# EAGLE design InternetButtonBuzzer (EAGLE 7.7.0)
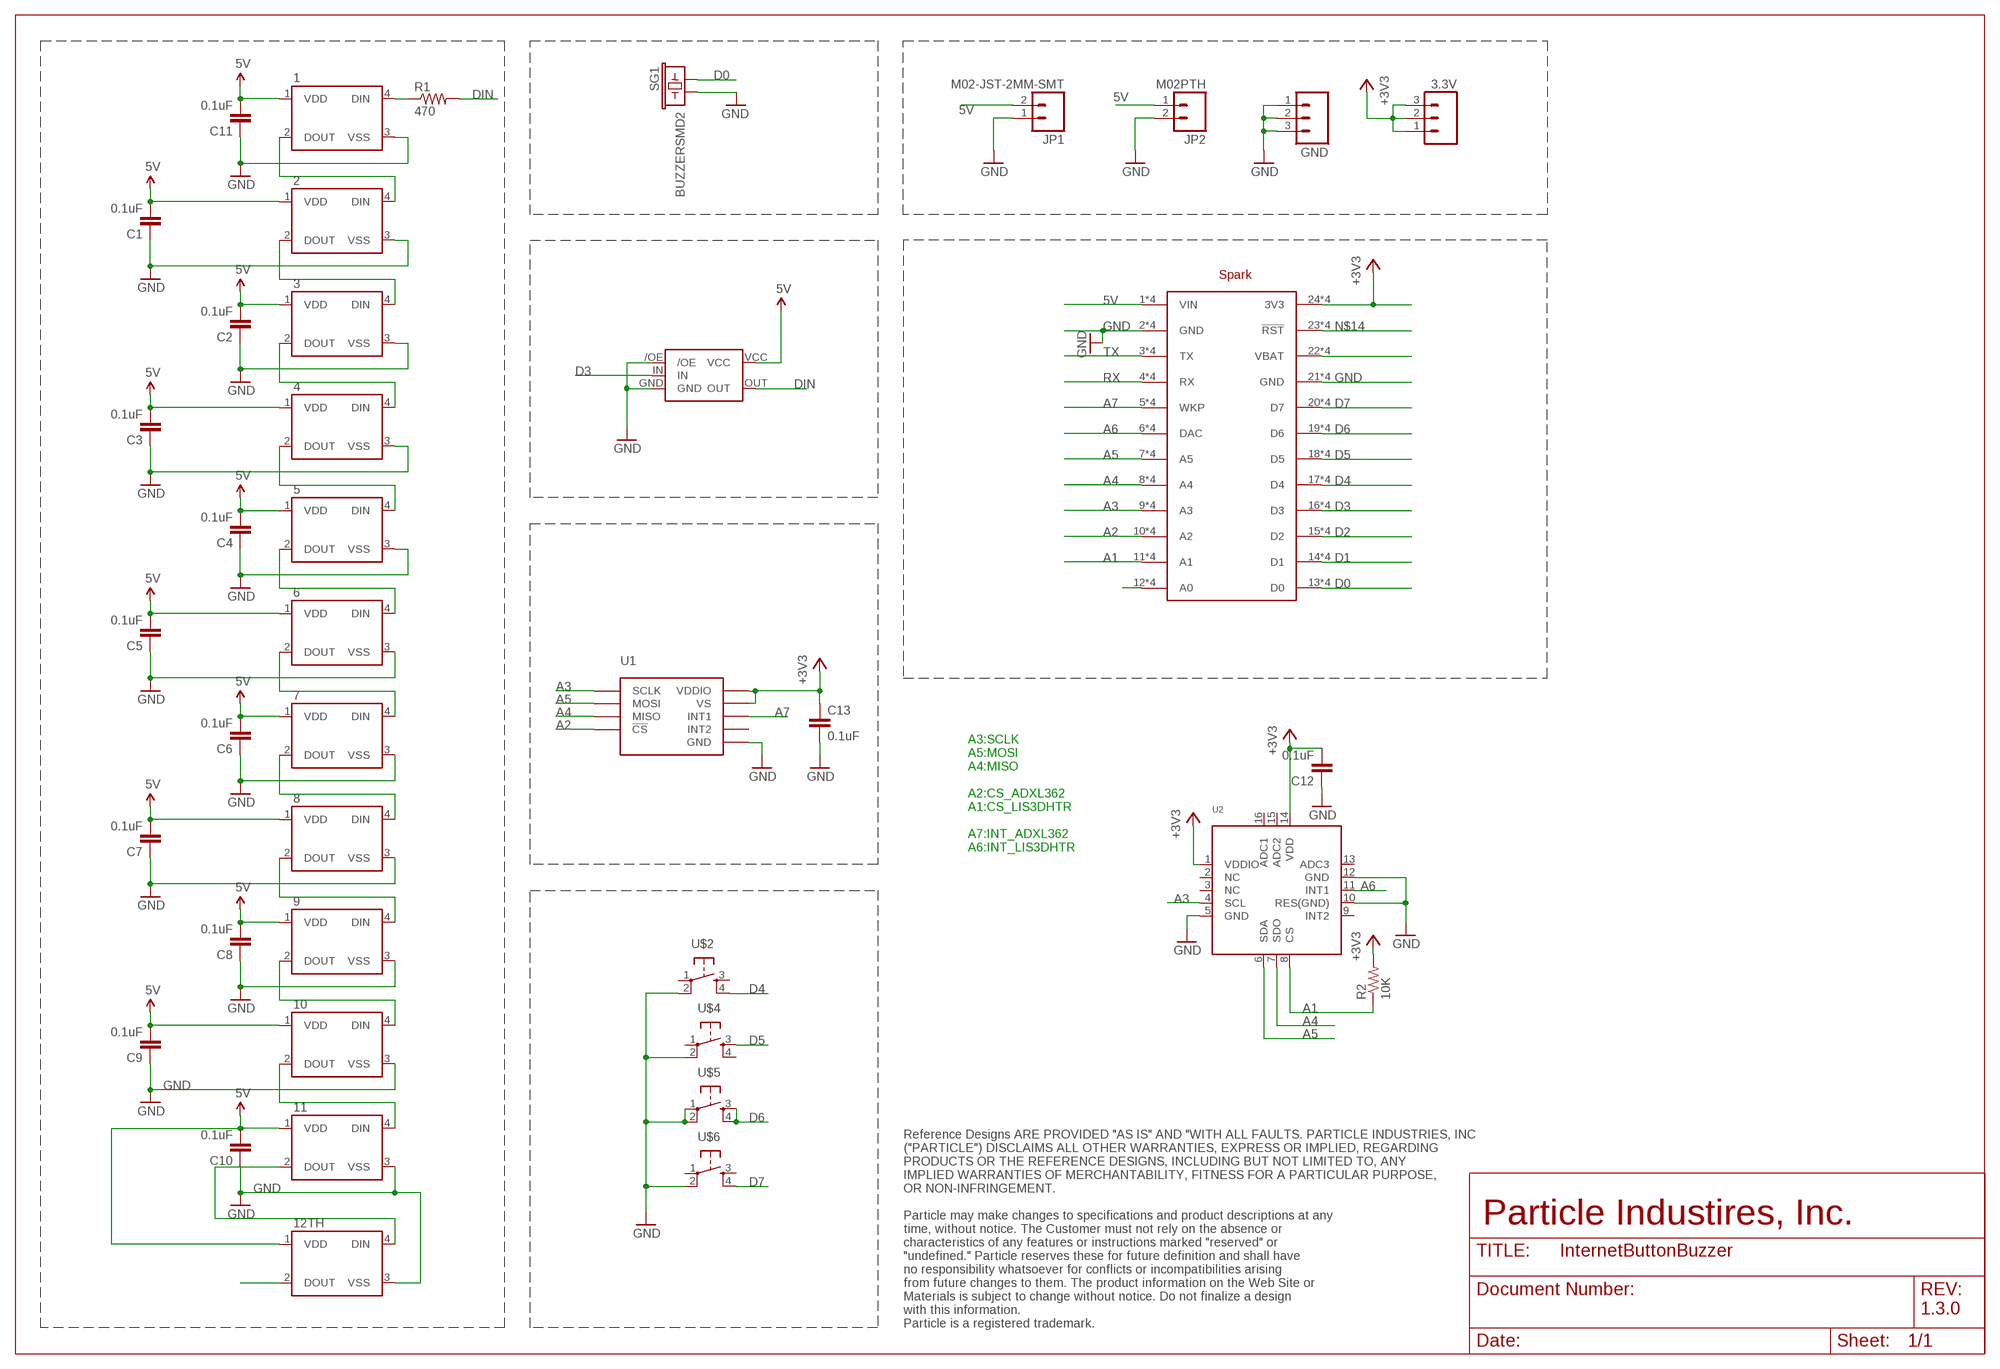
[diagram p0: schematic, sheet 1]

## Parts
1  WS2812B  [WS2812B]
2  WS2812B  [WS2812B]
3  WS2812B  [WS2812B]
3.3V  M03LOCK_NO_SILK  [1X03_LOCK_NO_SILK]
4  WS2812B  [WS2812B]
5  WS2812B  [WS2812B]
6  WS2812B  [WS2812B]
7  WS2812B  [WS2812B]
8  WS2812B  [WS2812B]
9  WS2812B  [WS2812B]
10  WS2812B  [WS2812B]
11  WS2812B  [WS2812B]
12TH  WS2812B  [NOCREAM_WS2812B]
C1  0.1uF  15PF-50V-5%(0603)  [0603-CAP]
C2  0.1uF  15PF-50V-5%(0603)  [0603-CAP]
C3  0.1uF  15PF-50V-5%(0603)  [0603-CAP]
C4  0.1uF  15PF-50V-5%(0603)  [0603-CAP]
C5  0.1uF  15PF-50V-5%(0603)  [0603-CAP]
C6  0.1uF  15PF-50V-5%(0603)  [0603-CAP]
C7  0.1uF  15PF-50V-5%(0603)  [0603-CAP]
C8  0.1uF  15PF-50V-5%(0603)  [0603-CAP]
C9  0.1uF  15PF-50V-5%(0603)  [0603-CAP]
C10  0.1uF  15PF-50V-5%(0603)  [0603-CAP]
C11  0.1uF  15PF-50V-5%(0603)  [0603-CAP]
C12  0.1uF  CAP0603-CAP  [0603-CAP]
C13  0.1uF  CAP0603-CAP  [0603-CAP]
GND  M03LOCK_NO_SILK  [1X03_LOCK_NO_SILK]
JP1  M02-JST-2MM-SMT  [JST-2-SMD]
JP2  M02PTH  [1X02]
R1  470  470OHM1/10W1%(0603)  [0603-RES]
R2  10K  470OHM1/10W1%(0603)  [0603-RES]
SG1  BUZZERSMD2  [BUZZER-CCV]
U1  ADXL362ADXL362-1:1  [ADXL362-1:1]
U2  ACCEL_LIS3DHTR  [LGA16_3X3MM]
U$2  12MM_TACTILE_SWITCH  [12MM_TACTILE_SWITCH]
U$3  SPARK_LOGO_WITH_PLANE  [SPARK_LOGO_PLUS_PLANE]
U$4  12MM_TACTILE_SWITCH  [12MM_TACTILE_SWITCH]
U$5  12MM_TACTILE_SWITCH  [12MM_TACTILE_SWITCH]
U$6  12MM_TACTILE_SWITCH  [12MM_TACTILE_SWITCH]
U$7  SPARK_COREDUAL_HEADER  [SPARK_CORE_DUAL_HEADER]
U$8  NL17SZ125SOT553  [SOT-553]

## Nets
5V: 1.1(VDD) 2.1(VDD) 3.1(VDD) 4.1(VDD) 5.1(VDD) 6.1(VDD) 7.1(VDD) 8.1(VDD) 9.1(VDD) 10.1(VDD) 11.1(VDD) 12TH.1(VDD) C1.2 C2.2 C3.2 C4.2 C5.2 C6.2 C7.2 C8.2 C9.2 C10.2 C11.2 JP1.2 JP2.1 U$7.1(VIN) U$7.1B(VIN) U$7.@1(VIN) U$7.@1B(VIN) U$8.VCC
+3V3: 3.3V.1 3.3V.2 3.3V.3 C12.2 C13.1 R2.2 U1.P$1(VDDIO) U1.P$14(VS) U2.1(VDDIO) U2.14(VDD) U$7.24(3V3) U$7.24B(3V3) U$7.@24(3V3) U$7.@24B(3V3)
A1: R2.1 U2.8(CS) U$7.11(A1) U$7.11B(A1) U$7.@11(A1) U$7.@11B(A1)
A2: U1.P$8(!CS) U$7.10(A2) U$7.10B(A2) U$7.@10(A2) U$7.@10B(A2)
A3: U1.P$4(SCLK) U2.4(SCL) U$7.9(A3) U$7.9B(A3) U$7.@9(A3) U$7.@9B(A3)
A4: U1.P$7(MISO) U2.7(SDO) U$7.8(A4) U$7.8B(A4) U$7.@8(A4) U$7.@8B(A4)
A5: U1.P$6(MOSI) U2.6(SDA) U$7.7(A5) U$7.7B(A5) U$7.@7(A5) U$7.@7B(A5)
A6: U2.11(INT1) U$7.6(DAC) U$7.6B(DAC) U$7.@6(DAC) U$7.@6B(DAC)
A7: U1.P$11(INT1) U$7.5(WKP) U$7.5B(WKP) U$7.@5(WKP) U$7.@5B(WKP)
D0: SG1.+ U$7.13(D0) U$7.13B(D0) U$7.@13(D0) U$7.@13B(D0)
D1: U$7.14(D1) U$7.14B(D1) U$7.@14(D1) U$7.@14B(D1)
D2: U$7.15(D2) U$7.15B(D2) U$7.@15(D2) U$7.@15B(D2)
D3: U$7.16(D3) U$7.16B(D3) U$7.@16(D3) U$7.@16B(D3) U$8.IN
D4: U$2.4 U$7.17(D4) U$7.17B(D4) U$7.@17(D4) U$7.@17B(D4)
D5: U$4.3 U$7.18(D5) U$7.18B(D5) U$7.@18(D5) U$7.@18B(D5)
D6: U$5.3 U$5.4 U$7.19(D6) U$7.19B(D6) U$7.@19(D6) U$7.@19B(D6)
D7: U$6.4 U$7.20(D7) U$7.20B(D7) U$7.@20(D7) U$7.@20B(D7)
DIN: R1.2 U$8.OUT
GND: 1.3(VSS) 2.3(VSS) 3.3(VSS) 4.3(VSS) 5.3(VSS) 6.3(VSS) 7.3(VSS) 8.3(VSS) 9.3(VSS) 10.3(VSS) 11.3(VSS) 12TH.3(VSS) C1.1 C2.1 C3.1 C4.1 C5.1 C6.1 C7.1 C8.1 C9.1 C10.1 C11.1 C12.1 C13.2 GND.1 GND.2 GND.3 JP1.1 JP2.2 SG1.- U1.P$12(GND) U1.P$13(GND) U1.P$16(GND) U2.5(GND) U2.10(RES(GND)) U2.12(GND) U$2.2 U$4.2 U$5.1 U$5.2 U$6.2 U$7.2(GND) U$7.2B(GND) U$7.21(GND) U$7.21B(GND) U$7.@2(GND) U$7.@2B(GND) U$7.@21(GND) U$7.@21B(GND) U$8./OE U$8.GND
N$1: 2.2(DOUT) 3.4(DIN)
N$2: 3.2(DOUT) 4.4(DIN)
N$3: 12TH.2(DOUT)
N$4: U$7.12(A0) U$7.12B(A0) U$7.@12(A0) U$7.@12B(A0)
N$5: 11.2(DOUT) 12TH.4(DIN)
N$8: 7.2(DOUT) 8.4(DIN)
N$9: 8.2(DOUT) 9.4(DIN)
N$11: 9.2(DOUT) 10.4(DIN)
N$12: 10.2(DOUT) 11.4(DIN)
N$14: U$7.23(!RST) U$7.23B(!RST) U$7.@23(!RST) U$7.@23B(!RST)
N$15: U$7.22(VBAT) U$7.22B(VBAT) U$7.@22(VBAT) U$7.@22B(VBAT)
N$16: 1.4(DIN) R1.1
N$17: 4.2(DOUT) 5.4(DIN)
N$18: 5.2(DOUT) 6.4(DIN)
N$19: 6.2(DOUT) 7.4(DIN)
N$24: 1.2(DOUT) 2.4(DIN)
RX: U$7.4(RX) U$7.4B(RX) U$7.@4(RX) U$7.@4B(RX)
TX: U$7.3(TX) U$7.3B(TX) U$7.@3(TX) U$7.@3B(TX)
Unconnected: U1.P$9(INT2) U2.2(NC) U2.3(NC) U2.9(INT2) U2.13(ADC3) U2.15(ADC2) U2.16(ADC1) U$2.1 U$2.3 U$4.1 U$4.4 U$6.1 U$6.3

## Notes on the sheet
- A3:SCLK
  A5:MOSI
  A4:MISO
  
  A2:CS_ADXL362
  A1:CS_LIS3DHTR
  
  A7:INT_ADXL362
  A6:INT_LIS3DHTR
- Particle Industires, Inc.
- 1.3.0
- Reference Designs ARE PROVIDED "AS IS" AND "WITH ALL FAULTS. PARTICLE INDUSTRIES, INC 
  ("PARTICLE") DISCLAIMS ALL OTHER WARRANTIES, EXPRESS OR IMPLIED, REGARDING 
  PRODUCTS OR THE REFERENCE DESIGNS, INCLUDING BUT NOT LIMITED TO, ANY 
  IMPLIED WARRANTIES OF MERCHANTABILITY, FITNESS FOR A PARTICULAR PURPOSE,
  OR NON-INFRINGEMENT.
  
  Particle may make changes to specifications and product descriptions at any 
  time, without notice. The Customer must not rely on the absence or 
  characteristics of any features or instructions marked "reserved" or 
  "undefined." Particle reserves these for future definition and shall have 
  no responsibility whatsoever for conflicts or incompatibilities arising 
  from future changes to them. The product information on the Web Site or 
  Materials is subject to change without notice. Do not finalize a design 
  with this information. 
  Particle is a registered trademark.

## Library data of the parts
1-11 = SparkFun-LED:WS2812B: WS2812B - Intelligent control LED integrated light source Technical Specifications: Power Supply Voltage (VDD): 3.5 to 5.3 V Input Voltage (VI): -0.5 to VDD+0.5 V Operating Junction Temperature (Topt): -25°C to +80°C Storage Temperature Range (Tstg): -55°C to +150°C
3.3V GND = SparkFun-Connectors:M03: Header 3 Standard 3-pin 0.1" header. Use with straight break away headers (SKU : PRT-00116), right angle break away headers (PRT-00553), swiss pins (PRT-00743), machine pins (PRT-00117), and female headers (PRT-00115). Molex polarized connector foot print use with SKU : PRT-08232 with associated crimp pins and housings.
12TH = Spark:WS2812B: WS2812B - Intelligent control LED integrated light source Technical Specifications: Power Supply Voltage (VDD): 3.5 to 5.3 V Input Voltage (VI): -0.5 to VDD+0.5 V Operating Junction Temperature (Topt): -25°C to +80°C Storage Temperature Range (Tstg): -55°C to +150°C
C1-C11 = SparkFun-Capacitors:15PF-50V-5%(0603): CAP-07881; PROD_ID: CAP-07881; VALUE: 15pF
C12 C13 = SparkFun-Passives:CAP: Capacitor Standard 0603 ceramic capacitor, and 0.1" leaded capacitor.
JP1 = SparkFun-Connectors:M02: Standard 2-pin 0.1" header. Use with - straight break away headers ( PRT-00116) - right angle break away headers (PRT-00553) - swiss pins (PRT-00743) - machine pins (PRT-00117) - female headers (PRT-00115) Molex polarized connector foot print use with: PRT-08233 with associated crimp pins and housings. 2.54_SCREWTERM for use with PRT-10571. 3.5mm Screw Terminal footprints for PRT-08084 5mm Screw Terminal footprints for use with PRT-08432; PROD_ID: CONN-08352
JP2 = SparkFun-Connectors:M02: Standard 2-pin 0.1" header. Use with - straight break away headers ( PRT-00116) - right angle break away headers (PRT-00553) - swiss pins (PRT-00743) - machine pins (PRT-00117) - female headers (PRT-00115) Molex polarized connector foot print use with: PRT-08233 with associated crimp pins and housings. 2.54_SCREWTERM for use with PRT-10571. 3.5mm Screw Terminal footprints for PRT-08084 5mm Screw Terminal footprints for use with PRT-08432
R1 = SparkFun-Resistors:470OHM1/10W1%(0603): RES-07869; PROD_ID: RES-07869
R2 = SparkFun-Resistors:470OHM1/10W1%(0603): RES-07869; PROD_ID: RES-07869; VALUE: 470
SG1 = SparkFun-Electromechanical:BUZZER: Buzzer 12mm Spark Fun Electronics SKU : Comp-Buzzer
U1 = SparkFun-Sensors:ADXL362: Micropower 3-axis accelerometer 2/4/8g digital output (SPI) IC-11297
U2 = asset-tracker-v008:ACCEL_LIS3DHTR: LIS3DHTR 3-Axis Accelerometer with I2C/SPI Interface VDD: 1.71-3.6V VDDIO: 1.71-VDD+0.1V Scale: +/-2g, 4g, 8g, 16g with 16--bit data output Temp:: -40°C - 85°C Mouser: 511-LIS3DHTR Digikey: 497-10613-1-ND
U$2 U$4-U$6 = Spark:12MM_TACTILE_SWITCH: 12MM tactile switch based on TL3300AF260Q http://www.digikey.com/product-detail/en/TL3300AF260Q/EG4903CT-ND/2498461
U$3 = Spark:SPARK_LOGO_WITH_PLANE
U$7 = Spark:SPARK_CORE
U$8 = Spark:NL17SZ125

## Board
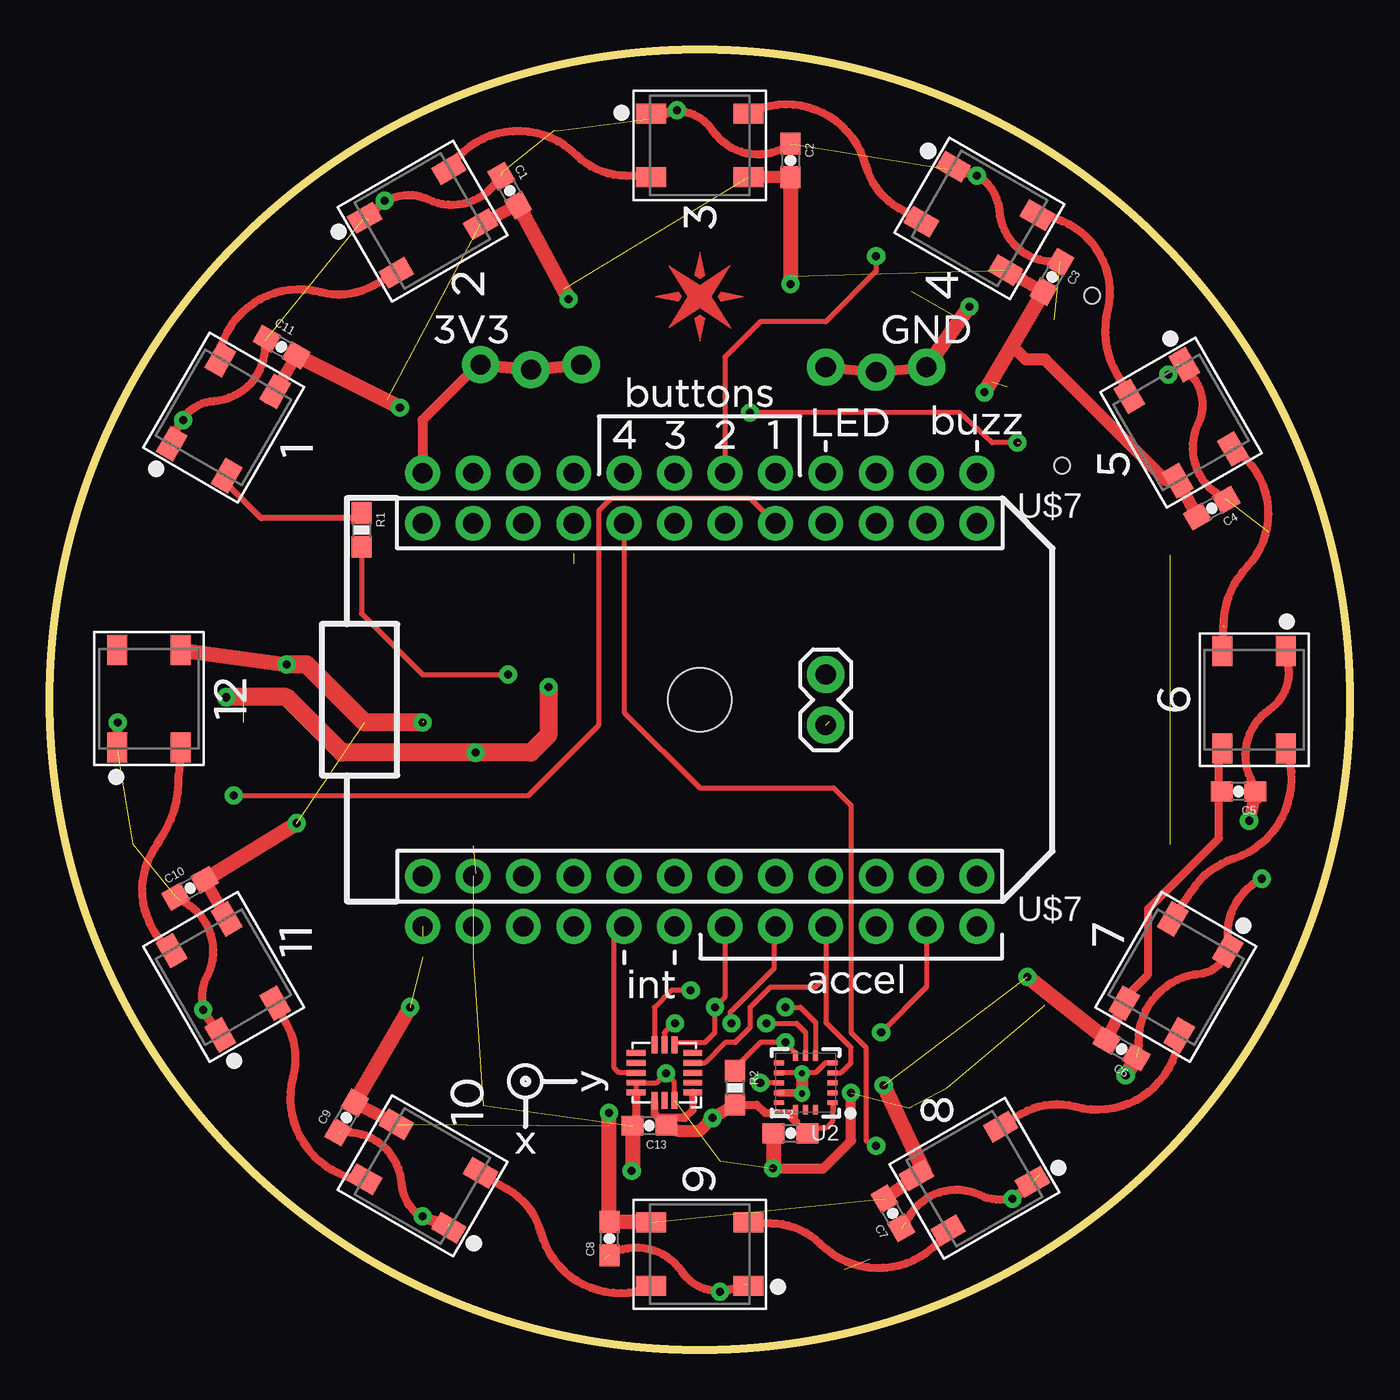
[diagram p1: board, top side]
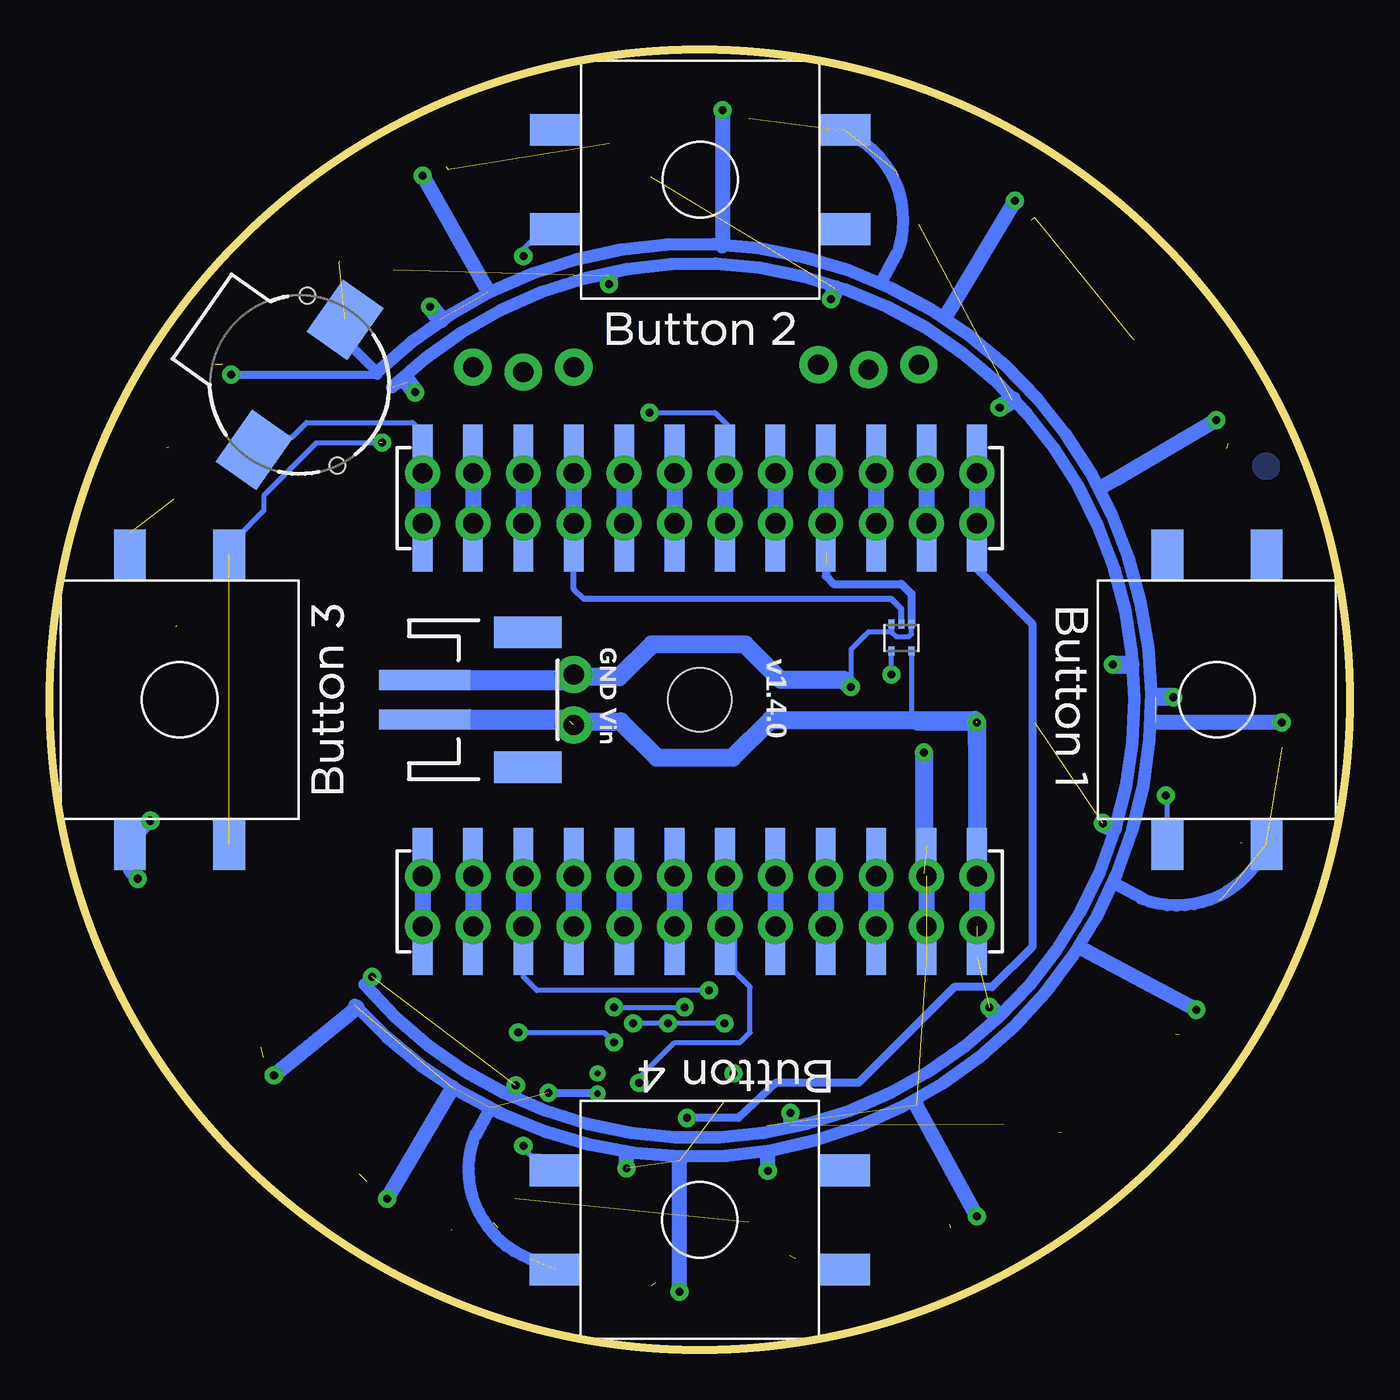
[diagram p2: board, bottom side, seen from below]

Size 65.53 x 65.53 mm. Coordinates in mm from the lower left corner, seen from the top.
Outline: circle at 32.77,32.77 radius 32.77
Copper layers (1*16): Top 0.035mm / dielectric 1.5mm / Bottom 0.035mm
Design rules "SparkFun-2-layer": minimum track width 7mil, minimum drill 15mil, track to track 8mil, track to pad 8mil, pad to pad 8mil, via to via 8mil, smd to smd 8mil, copper to edge 8mil, drill to drill 8mil, minimum pad ring 12mil, minimum via ring 10mil, stop-mask expansion 4mil, vias tented up to drill 20mil, thermal gap 10mil
Holes 3.17 mm at 32.77,32.77

### Footprints (pad centres in the part's own frame; a part is rotated, then mirrored left to right if it is on the bottom)
WS2812B = smd 1.5 x 1: 1 -2.45,1.6; 2 -2.45,-1.6; 3 2.45,-1.6; 4 2.45,1.6
1X03_LOCK_NO_SILK = drill 1.016 pad 1.88: 1 0,0.127; 2 2.54,-0.127; 3 5.08,0.127
NOCREAM_WS2812B = smd 1.5 x 1: 1 -2.45,1.6; 2 -2.45,-1.6; 3 2.45,-1.6; 4 2.45,1.6
0603-CAP = smd 1.1 x 1: 1 -0.85,0; 2 0.85,0
JST-2-SMD = smd 1 x 4.6: 1 -1,-3.7; 2 1,-3.7 | smd 1.6 x 3.4: NC1 -3.4,1.5; NC2 3.4,1.5
1X02 = drill 1.016 pad 1.88: 1 0,0; 2 2.54,0
0603-RES = smd 1.1 x 1: 1 -0.85,0; 2 0.85,0
BUZZER-CCV = smd 3.2 x 2.5: + 4,0; - -4,0 | hole 0.8: -3.9,-2.25; 2.25,3.9
ADXL362-1:1 = smd 0.952 x 0.3: P$1 -1.426,1; P$2 -1.426,0.5; P$3 -1.426,0; P$4 -1.426,-0.5; P$5 -1.426,-1; P$9 1.426,-1; P$10 1.426,-0.5; P$11 1.426,0; P$12 1.426,0.5; P$13 1.426,1 | smd 0.3 x 0.851: P$6 -0.5,-1.402; P$7 0,-1.402; P$8 0.5,-1.402; P$14 0.5,1.402; P$15 0,1.402; P$16 -0.5,1.402
LGA16_3X3MM = smd 0.5 x 0.25: 1 -1.35,1; 2 -1.35,0.5; 3 -1.35,0; 4 -1.35,-0.5; 5 -1.35,-1; 9 1.35,-1; 10 1.35,-0.5; 11 1.35,0; 12 1.35,0.5; 13 1.35,1 | smd 0.25 x 0.5: 6 -0.5,-1.35; 7 0,-1.35; 8 0.5,-1.35; 14 0.5,1.35; 15 0,1.35; 16 -0.5,1.35
12MM_TACTILE_SWITCH = smd 2.54 x 1.6: 1 -7.3,2.5; 2 7.3,2.5; 3 -7.3,-2.5; 4 7.3,-2.5
SPARK_CORE_DUAL_HEADER = drill 1.016 pad 1.753: 1 -8.89,13.97; 2 -8.89,11.43; 3 -8.89,8.89; 4 -8.89,6.35; 5 -8.89,3.81; 6 -8.89,1.27; 7 -8.89,-1.27; 8 -8.89,-3.81; 9 -8.89,-6.35; 10 -8.89,-8.89; 11 -8.89,-11.43; 12 -8.89,-13.97; 13 8.89,-13.97; 14 8.89,-11.43; 15 8.89,-8.89; 16 8.89,-6.35; 17 8.89,-3.81; 18 8.89,-1.27; 19 8.89,1.27; 20 8.89,3.81; 21 8.89,6.35; 22 8.89,8.89; 23 8.89,11.43; 24 8.89,13.97; @1 -11.43,13.97; @2 -11.43,11.43; @3 -11.43,8.89; @4 -11.43,6.35; @5 -11.43,3.81; @6 -11.43,1.27; @7 -11.43,-1.27; @8 -11.43,-3.81; @9 -11.43,-6.35; @10 -11.43,-8.89; @11 -11.43,-11.43; @12 -11.43,-13.97; @13 11.43,-13.97; @14 11.43,-11.43; @15 11.43,-8.89; @16 11.43,-6.35; @17 11.43,-3.81; @18 11.43,-1.27; @19 11.43,1.27; @20 11.43,3.81; @21 11.43,6.35; @22 11.43,8.89; @23 11.43,11.43; @24 11.43,13.97 | smd 1.829 x 0.991 bottom: 1B -7.366,13.97; 2B -7.366,11.43; 3B -7.366,8.89; 4B -7.366,6.35; 5B -7.366,3.81; 6B -7.366,1.27; 7B -7.366,-1.27; 8B -7.366,-3.81; 9B -7.366,-6.35; 10B -7.366,-8.89; 11B -7.366,-11.43; 12B -7.366,-13.97; 13B 7.366,-13.97; 14B 7.366,-11.43; 15B 7.366,-8.89; 16B 7.366,-6.35; 17B 7.366,-3.81; 18B 7.366,-1.27; 19B 7.366,1.27; 20B 7.366,3.81; 21B 7.366,6.35; 22B 7.366,8.89; 23B 7.366,11.43; 24B 7.366,13.97; @1B -12.954,13.97; @2B -12.954,11.43; @3B -12.954,8.89; @4B -12.954,6.35; @5B -12.954,3.81; @6B -12.954,1.27; @7B -12.954,-1.27; @8B -12.954,-3.81; @9B -12.954,-6.35; @10B -12.954,-8.89; @11B -12.954,-11.43; @12B -12.954,-13.97; @13B 12.954,-13.97; @14B 12.954,-11.43; @15B 12.954,-8.89; @16B 12.954,-6.35; @17B 12.954,-3.81; @18B 12.954,-1.27; @19B 12.954,1.27; @20B 12.954,3.81; @21B 12.954,6.35; @22B 12.954,8.89; @23B 12.954,11.43; @24B 12.954,13.97
SOT-553 = smd 0.3 x 0.45: /OE -0.5,0; GND 0.5,0; IN 0,0; OUT 0.5,1.35; VCC -0.5,1.35

### Placement (x,y rotation side)
1  8.76,46.99 240 top
2  18.8,56.9 210 top
3  32.77,60.71 180 top
3.3V  21.72,49.53 0 top
4  46.86,57.02 150 top
5  57.02,46.74 120 top
6  60.71,32.77 90 top
7  56.77,18.8 60 top
8  46.61,8.64 30 top
9  32.77,4.83 0 top
10  18.8,8.76 330 top
11  8.76,18.8 300 top
12TH  5,32.82 270 top
C1  23.19,58.42 300 top
C2  37.34,59.94 270 top
C3  50.52,54.08 240 top
C4  58.57,42.42 210 top
C5  59.92,28.14 180 top
C6  54.03,15.16 150 top
C7  42.49,6.88 120 top
C8  28.22,5.61 90 top
C9  14.96,11.71 60 top
C10  7.09,23.27 30 top
C11  11.68,50.55 330 top
C12  37.34,10.92 0 top
C13  30.23,11.3 180 top
GND  39.12,49.4 0 top
JP1  42.93,32.77 270 bottom
JP2  39.12,31.5 90 top
R1  15.72,41.33 270 top
R2  34.54,13.21 270 top
SG1  52.93,48.64 235 bottom
U1  30.99,13.97 180 top
U2  38.1,13.46 180 top
U$2  6.71,32.77 270 bottom
U$3  32.77,53.09 0 top
U$4  32.74,58.98 0 bottom
U$5  58.98,32.77 90 bottom
U$6  32.77,6.55 180 bottom
U$7  32.77,32.77 90 top
U$8  22.61,36.58 180 bottom

### Tracks (layer width: path | path; a pad name or v marks a point on that pad's centre or on a via)
5V  (via drill 0.41)  (12 unrouted)
  Top 0.254: 6.1 59.44,30.23
  Top 0.406: 10.94,47.88 1.1 | 7.1 54.16,17.71 55.37,18.92 55.37,22.22 58.93,25.78 58.93,28.19 | 58.93,28.19 58.93,30.14 6.1 | C5.2 58.98,28.14 58.93,28.19
  Top 0.61: 7.1 C6.2 52.96,15.87 | C4.2 5.1 56.26,43.81 50.16,49.91 49.19,49.91 48.49,50.61 | C3.2 4.1 | C2.2 3.1 | C1.2 2.1 | C11.2 1.1 | C7.2 8.1 42.29,7.75 44.07,9.02 | C9.2 10.1 15.37,12.45 | 11.1 C10.2 | 9.1 28.19,6.48
  Top 0.762: 9.1 C8.2 | 52.96,15.87 50.55,17.78 v49.28,18.8 | C3.2 48.49,50.61 v47.12,48.26 | C2.2 v37.34,53.72 | C1.2 v26.16,52.96 | C11.2 v17.65,47.5 | C10.2 v12.45,26.54 | 15.37,12.45 v18.16,17.27 | 28.19,6.48 v28.19,11.94 | 44.07,9.02 v42.04,13.33 | 12TH.1 v11.94,34.54
  Top 0.914: v18.8,31.62 15.88,31.62 12.95,34.54 v11.94,34.54
  Bottom 0.254: U$8.VCC 22.11,31.94 21.84,31.67 | 18.8,25.91 U$7.1B
  Bottom 0.406: U$7.@1B 18.8,20.83 | U$7.@1 U$7.1 18.8,24.38 18.8,25.91
  Bottom 0.508: v42.04,13.33 42.29,12.83
  Bottom 0.61: v49.28,18.8 49.66,18.41
  Bottom 0.635: 49.66,18.41 arc-274 48.26,48.51
  Bottom 0.762: v28.19,11.94 28.19,11.3
  Bottom 0.889: v26.16,52.96 25.91,53.47
  Bottom 0.914: 21.84,31.67 18.85,31.67 | v47.12,48.26 47.5,48.77 | v37.34,53.72 37.34,54.1 | v17.65,47.5 17.02,47.88 | v12.45,26.54 11.94,26.29 | v18.16,17.27 17.78,16.89 | 18.8,30.48 v18.8,31.62 | v11.94,34.54 11.05,34.54 | v18.8,31.62 18.8,24.38 | 39.29,31.67 36.75,31.67 34.92,29.84 31.12,29.84 29.21,31.75 18.92,31.75 v18.8,31.62
  Bottom 1.016: JP1.2 39.39,31.77 39.29,31.67
+3V3  (via drill 0.41 pad 0.91)
  Top 0.254: U2.1 39.45,11.51 39.12,11.18 38.44,11.18 C12.2 37.64,11.47 37.6,11.51 U2.14 37.34,11.85 | C13.1 31.12,11.3 31.62,11.05
  Top 0.381: U1.P$14 30.49,11.89 | U1.P$1 32.41,12.09 32,11.68
  Top 0.406: R2.2 35.65,12.36 36.07,11.94 37.17,11.94 37.64,11.47 | 30.99,11.3 C13.1 30.71,11.66 | 30.49,11.89 30.71,11.66 | 32,11.68 30.73,11.68 30.71,11.66
  Top 0.508: 3.3V.1 21.59,49.66 18.8,46.86 U$7.@24
  Top 0.61: 3.3V.1 3.3V.2 3.3V.3 | R2.2 v33.4,11.68 32.77,11.05 31.62,11.05
  Bottom 0.406: U$7.24 U$7.24B | U$7.24B U$7.@24 | U$7.24B 18.8,39.37 16,36.58 16,20.32 18.03,18.29 19.94,18.29 24.77,13.46 28.92,13.46 30.82,11.68 v33.4,11.68
  Bottom 0.61: U$7.@24B U$7.@24
A1  (via drill 0.41 pad 0.91)
  Top 0.254: U2.8 37.6,14.98 v37.08,15.49 35.81,15.49 34.54,14.22 R2.1 | U$7.@11 44.2,18.29 v41.91,16
  Bottom 0.254: 37.34,15.75 v37.08,15.49 37.59,16 v41.91,16
  Bottom 0.406: U$7.@11B U$7.@11 U$7.11 U$7.11B
A2  (via drill 0.41 pad 0.51)
  Top 0.254: 30.48,15.36 30.48,17.27 31.32,18.11 v32.31,18.11 | 30.48,15.13 30.48,15.36 | 30.48,15.36 arc-90 U1.P$8
  Bottom 0.254: v32.31,18.11 40.97,18.11 41.66,18.8 U$7.@10B
  Bottom 0.406: U$7.10B U$7.10 U$7.@10 U$7.@10B
A3
  Top 0.254: U1.P$4 33.02,14.47 34.04,15.49 34.54,15.49 35.31,16.26 35.31,17.27 36.32,18.29 38.61,18.29 39.12,18.8 | U$7.@9 39.12,18.8 | 39.12,18.8 39.12,16.51 40.39,15.24 40.39,14.48 39.87,13.96 U2.4
  Bottom 0.406: U$7.@9B U$7.@9 U$7.9 U$7.9B
A4  (via drill 0.41, 0.41 pad 0.61, 0.41 pad 0.91)
  Top 0.254: v31.52,16.46 31.45,16.46 30.99,16 U1.P$7 | U$7.@8 36.52,21.28 36.52,19.25 34.29,17.02 34.29,16.53 v34.37,16.46 | v36.12,16.46 37.64,16.46 38.1,16 U2.7
  Bottom 0.254: v31.52,16.46 v34.37,16.46 v36.12,16.46
  Bottom 0.406: U$7.8B U$7.8 U$7.@8 U$7.@8B
A5  (via drill 0.41 pad 0.91)
  Top 0.254: 31.49,15.23 U1.P$6 31.49,15.49 31.5,15.49 33.02,15.49 33.53,16 v33.53,17.27 34.04,17.78 U$7.@7 | U2.6 38.61,14.82 38.61,16.51 37.85,17.27 v37.08,17.27
  Bottom 0.254: v37.08,17.27 v33.53,17.27
  Bottom 0.406: U$7.@7B U$7.@7 U$7.7 U$7.7B
A6  (via drill 0.41 pad 0.91)
  Top 0.254: U2.11 v35.81,13.46
  Bottom 0.254: v35.81,13.46 35.81,13.72 34.04,15.49 30.73,15.49 30.23,16 30.23,18.29 30.99,19.05 30.99,20.83 U$7.@6
  Bottom 0.406: U$7.6B U$7.6 U$7.@6 U$7.@6B
A7
  Top 0.254: U1.P$11 28.7,13.97 28.45,14.22 28.45,20.83 U$7.@5
  Bottom 0.254: U$7.@5B 29.21,19.81
  Bottom 0.406: U$7.@5B U$7.@5 U$7.5 U$7.5B
D0
  Bottom 0.254: 54.87,45.72 54.62,45.97 53.34,45.97 52.58,46.74 47.24,46.74 46.86,46.35 46.86,45.85 U$7.@13B
  Bottom 0.406: U$7.13B U$7.13 U$7.@13 U$7.@13B
  Bottom 0.61: 54.87,45.72 SG1.+
D1
  Bottom 0.406: U$7.@14B U$7.@14 U$7.14 U$7.14B
D2
  Bottom 0.406: U$7.15B U$7.15 U$7.@15 U$7.@15B
D3
  Bottom 0.254: U$7.16B 39.12,40.64
  Bottom 0.305: U$8.IN 22.61,37.34 23.11,37.85 38.61,37.85 39.12,38.35 39.12,40.64 39.12,41.15
  Bottom 0.406: U$7.@16B U$7.@16 U$7.16 39.12,40.64
D4  (via drill 0.41)
  Top 0.254: v9.27,27.94 24.13,27.94 27.69,31.5 27.69,42.29 28.32,42.93 35.31,42.93 U$7.17
  Bottom 0.254: U$2.4 9.21,27.87 v9.27,27.94
  Bottom 0.61: U$7.17B U$7.17 U$7.@17 U$7.@17B
D5  (via drill 0.41)
  Top 0.254: v41.66,55.12 41.66,54.36 39.12,51.82 35.81,51.82 34.04,50.04 U$7.@18
  Bottom 0.254: U$4.3 40.68,56.48 41.66,55.5 v41.66,55.12
  Bottom 0.61: U$7.@18B U$7.@18 | 34.04,43.56 U$7.@18 | U$7.@18 U$7.18 U$7.18B
D6  (via drill 0.41 pad 0.91)  (2 unrouted)
  Top 0.254: v48.77,45.72 47.5,45.72 45.85,47.24 v35.31,47.24
  Bottom 0.254: U$7.19 U$7.19B | 56.48,40.42 U$5.4 56.13,40.41 56.13,40.89 54.74,42.29 54.74,43.05 52.07,45.72 48.89,45.72 | v35.31,47.24 32,47.24 31.37,46.61 31.37,44.32 U$7.@19
  Bottom 0.61: U$7.19 U$7.@19 U$7.@19B
D7  (via drill 0.41)
  Top 0.254: v41.66,10.29 41.15,10.54 41.15,15.24 40.39,16 40.39,27.43 39.5,28.32 32.77,28.32 28.96,32.13 U$7.20
  Bottom 0.254: 39.62,9.02 39.75,8.89 41.02,9.14 40.96,9.21 40.3,9.05 U$6.4 40.79,9.78 41.27,9.78 41.66,10.16 v41.66,10.29
  Bottom 0.61: U$7.@20B U$7.@20 U$7.20 U$7.20B
DIN  (via drill 0.41)
  Top 0.254: R1.2 15.72,37.11 18.8,34.04 v23.11,34.04
  Bottom 0.254: v23.11,34.04 23.11,34.81 U$8.OUT
GND  (via drill 0.3 pad 0.71, 0.41)  (41 unrouted)
  Top 0.254: U2.10 36.76,13.97 37.63,13.97 37.63,13.93 v37.92,13.93 37.95,13.97 38.61,13.97 39.1,14.46 U2.5 | U1.P$16 31.49,13.5 v31.06,13.93 30.6,13.47 U1.P$12 U1.P$13 | v37.92,12.92 37.55,12.92
  Top 0.381: U2.12 37.87,12.96
  Top 0.406: 37.87,12.96 v37.92,12.92 | 30.28,62.05 arc-90 33.4,61.47 arc92 C2.1 | 14.67,10.94 arc-92 17.74,8.39 arc90 20.16,6.32 v18.8,6.73 | 35,3.35 arc-90 31.88,3.94 arc92 27.94,4.61 | 43.15,6.41 arc-92 46.9,7.79 arc90 49.9,8.85 v48.51,7.62 | 59.38,20.86 arc-90 58.07,18.95 arc92 54.88,15.25 | 60.79,28.32 arc-92 61.47,32.26 arc90 62.05,35.38 62.05,34.98 62.48,34.54 62.48,35.04 6.3 | 56.82,49.66 arc-90 57.88,46.66 arc92 59.26,42.91 | 50.93,54.86 arc-92 47.86,57.41 arc90 45.45,59.48 v46.74,59.18 | 16.08,56.93 arc-90 19.08,57.98 arc92 22.82,59.37 | 10.86,50.9 arc-92 8.3,47.83 arc90 6.24,45.41 6.35,45.41 6.35,46.35 v6.73,46.86 | 2.3 v16.89,57.91 | 30.28,62.05 3.3 | 30.28,62.05 v31.62,62.48 | 5.3 v56.39,49.15 | 11.3 v7.75,17.14 | 9.3 v33.78,2.92 | U1.P$13 29.56,11.49 C13.2 | 36.49,9.18 v36.45,9.14 | 29.38,9.06 v29.34,9.02 | 59.38,20.86 arc-64 v61.09,23.75 | 59.38,20.86 7.3 | 8.78,15.9 arc-90 7.98,18.9 arc92 6.6,22.65
  Top 0.508: v36.45,9.14 38.99,9.14 40.39,10.54 v40.39,12.95 | 12TH.3 v3.43,31.62 | GND.1 GND.2 GND.3
  Top 0.61: v37.92,13.93 v37.92,12.92 | C5.1 60.66,27.64 | 60.66,27.64 v60.45,26.67 | 60.79,28.32 arc-95 60.66,27.64
  Top 0.762: C6.1 v54.23,13.84 | C12.1 36.49,9.18 | C13.2 29.38,9.06 | GND.3 v46.35,52.58
  Top 0.914: v25.15,33.4 25.15,30.99 24.26,30.1 v21.46,30.1 14.73,30.1 11.94,32.89 v8.89,32.89
  Bottom 0.254: 37.85,12.85 v37.92,12.92 | 61.48,40.22 61.48,41.19 | U$8.GND 23.11,36.19 | 23.11,36.19 22.86,35.94 22.22,35.94 22.1,36.07 U$8./OE | U$7.@21 26.42,39.62 | 23.11,36.19 24.27,36.19 25.15,35.31 v25.15,33.4
  Bottom 0.406: 61.48,40.22 U$5.2 | v40.39,12.95 37.95,12.95 v37.92,12.92 | 29.34,9.78 29.46,9.91 | U$7.21 26.42,39.62 26.42,38.99 26.04,38.61 22.61,38.61 22.1,38.1 U$8./OE | v56.39,49.15 49.15,49.15 49.02,49.28
  Bottom 0.508: 9.78,31.62 9.91,31.5 | SG1.- 50.64,50.89 49.02,49.28 49.02,49.15
  Bottom 0.61: U$2.2 arc90 10.49,22.73 10.41,22.73 11.81,23.49 | 25.59,61.45 arc90 22.86,55.16 22.86,55.24 23.62,53.85 | v60.45,26.67 U$5.1 arc-94 v61.09,23.75 | U$7.@21B U$7.@21 | 41.34,4.59 arc90 44.07,10.88 44.07,10.79 43.31,12.19
  Bottom 0.635: 50.16,17.4 arc-272 49.02,49.28
  Bottom 0.762: v6.73,46.86 11.68,43.94 12.57,43.43 | v16.89,57.91 20.32,52.2 | v31.62,62.48 31.62,55.63 | v46.74,59.18 43.43,53.34 | v7.75,17.14 13.46,20.19 | v18.8,6.73 21.84,12.32 | v33.78,2.92 33.78,9.52 | v48.51,7.62 45.21,13.21 | v54.23,13.84 50.04,17.27 | v36.45,9.14 36.45,9.91 | v29.34,9.02 29.34,9.78 | v3.43,31.62 9.78,31.62
  Bottom 0.914: v25.15,33.4 25.51,33.77 28.69,33.77 30.48,35.56 35.18,35.56 36.83,33.91 39.48,33.91 39.62,33.77 | v21.46,30.1 21.46,24 U$7.2 | v8.89,32.89 9.78,32.89 | v46.35,52.58 45.85,51.94
  Bottom 1.016: JP1.1 39.62,33.77 39.39,33.77 JP2.2
N$1
  Top 0.406: 2.2 2.2 arc-102 26.55,60.21 arc45 29.06,59.17 30.38,59.16 30.32,59.16 3.4
N$2
  Top 0.406: 4.4 42.8,57.53 arc-45 41.15,59.69 arc102 3.2
N$3
  pour Bottom (no thermals): 4.19,43.97 arc-90 3.63,44.53 arc-90 4.19,45.08 4.29,45.08 arc-90 4.8,44.53 arc-90
N$4
  Bottom 0.406: U$7.@12 U$7.@12B U$7.12 U$7.12B
N$5  (1 unrouted)
  Top 0.406: 11.2 arc-90 5.51,25.58 | 12TH.4 6.5,28.96 arc-40 5.44,25.55
N$8
  Top 0.406: 8.4 47.84,11.25 47.84,11.26 48.99,11.91 arc-45 51.69,12.26 arc102 56.97,16.04 7.2
N$9  (1 unrouted)
  Top 0.406: 45.29,6.04 45.28,6.04 arc-102 38.84,5.34 arc45 36.33,6.39 35.01,6.4 35.22,6.4 9.4
N$11
  Top 0.406: 10.4 21.95,8.92 21.95,8.77 23.09,8.1 arc-45 24.74,5.94 arc102 30.67,3.33 30.32,3.33 9.2
N$12
  Top 0.406: 10.2 16.09,8.6 16.09,8.54 arc-102 12.27,13.77 arc45 11.91,16.46 11.26,17.61 11.37,17.61 11.4
N$14
  Bottom 0.61: U$7.23B U$7.23 U$7.@23 U$7.@23B
N$15
  Bottom 0.61: U$7.@22B U$7.@22 U$7.22 U$7.22B
N$16
  Top 0.254: 9.05,44.2 1.4 | R1.1 15.71,42.19
  Top 0.305: 15.71,42.19 15.43,41.91 10.67,41.91 8.92,43.65 1.4
N$17
  Top 0.406: 4.2 49.61,57.18 49.61,57.18 arc-102 53.34,52.41 arc45 53.82,49.15 54.45,48.18 54.41,48.18 5.4
N$18  (2 unrouted)
  Top 0.406: 59.15,36.5 59.14,35.18 59.11,35.18 6.4 | 59.62,45.46 59.63,45.46 5.2 | 59.17,36.44 arc-45 60.38,39.49 arc102 59.54,45.49
N$19
  Top 0.406: 7.4 57.53,23.11 arc-38 59.69,24.76 arc93 6.2
N$24
  Top 0.406: 8.47,49.54 8.6,49.54 1.2 8.6,49.47 8.44,49.47 8.43,49.47 8.42,49.47 arc-102 13.66,53.3 arc45 16.35,53.65 17.37,54.18 17.47,54.18 2.4 17.42,54.28 17.42,54.24
RX
  Bottom 0.406: U$7.4B U$7.4 U$7.@4 U$7.@4B
TX
  Bottom 0.406: U$7.@3B U$7.@3 U$7.3 U$7.3B

### Text on the board
bPlace: v1.4.0
tDocu: Reference Designs ARE PROVIDED "AS IS" AND "WITH ALL FAULTS. PARTICLE INDUSTRIES, INC / ("PARTICLE") DISCLAIMS ALL OTHER WARRANTIES, EXPRESS OR IMPLIED, REGARDING / PRODUCTS OR THE REFERENCE DESIGNS, INCLUDING BUT NOT LIMITED TO, ANY / IMPLIED WARRANTIES OF MERCHANTABILITY, FITNESS FOR A PARTICULAR PURPOSE, / OR NON-INFRINGEMENT. / / Particle may make changes to specifications and product descriptions at any / time, without notice. The Customer must not rely on the absence or / characteristics of any features or instructions marked "reserved" or / "undefined." Particle reserves these for future definition and shall have / no responsibility whatsoever for conflicts or incompatibilities arising / from future changes to them. The product information on the Web Site or / Materials is subject to change without notice. Do not finalize a design / with this information. / Particle is a registered trademark.